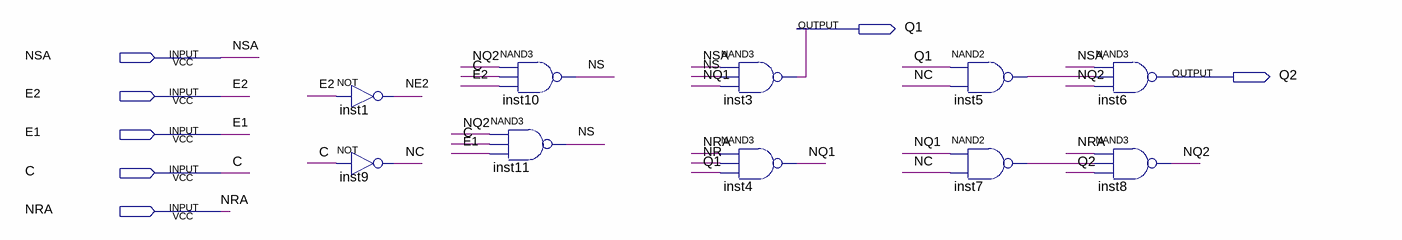
[diagram p0: schematic sheet]
// Quartus schematic jk.bdf as structural Verilog: 10 symbols, 7 pins
module jk (
  input  NSA,
  input  E2,
  input  E1,
  input  C,
  input  NRA,
  output Q1,
  output Q2
);

  wire inst5_out, inst7_out, NC, NE2, NQ1, NQ2, NR, NS;

  not inst1 (NE2, E2);
  not inst9 (NC, C);
  nand inst10 (NS, NQ2, C, E2);
  nand inst11 (NS, NQ2, C, E1);
  nand inst3 (Q1, NSA, NS, NQ1);
  nand inst4 (NQ1, NRA, NR, Q1);
  nand inst5 (inst5_out, Q1, NC);
  nand inst7 (inst7_out, NQ1, NC);
  nand inst6 (Q2, NSA, inst5_out, NQ2);
  nand inst8 (NQ2, NRA, inst7_out, Q2);
endmodule
